# EAGLE design weatherstation (EAGLE 9.6.2)
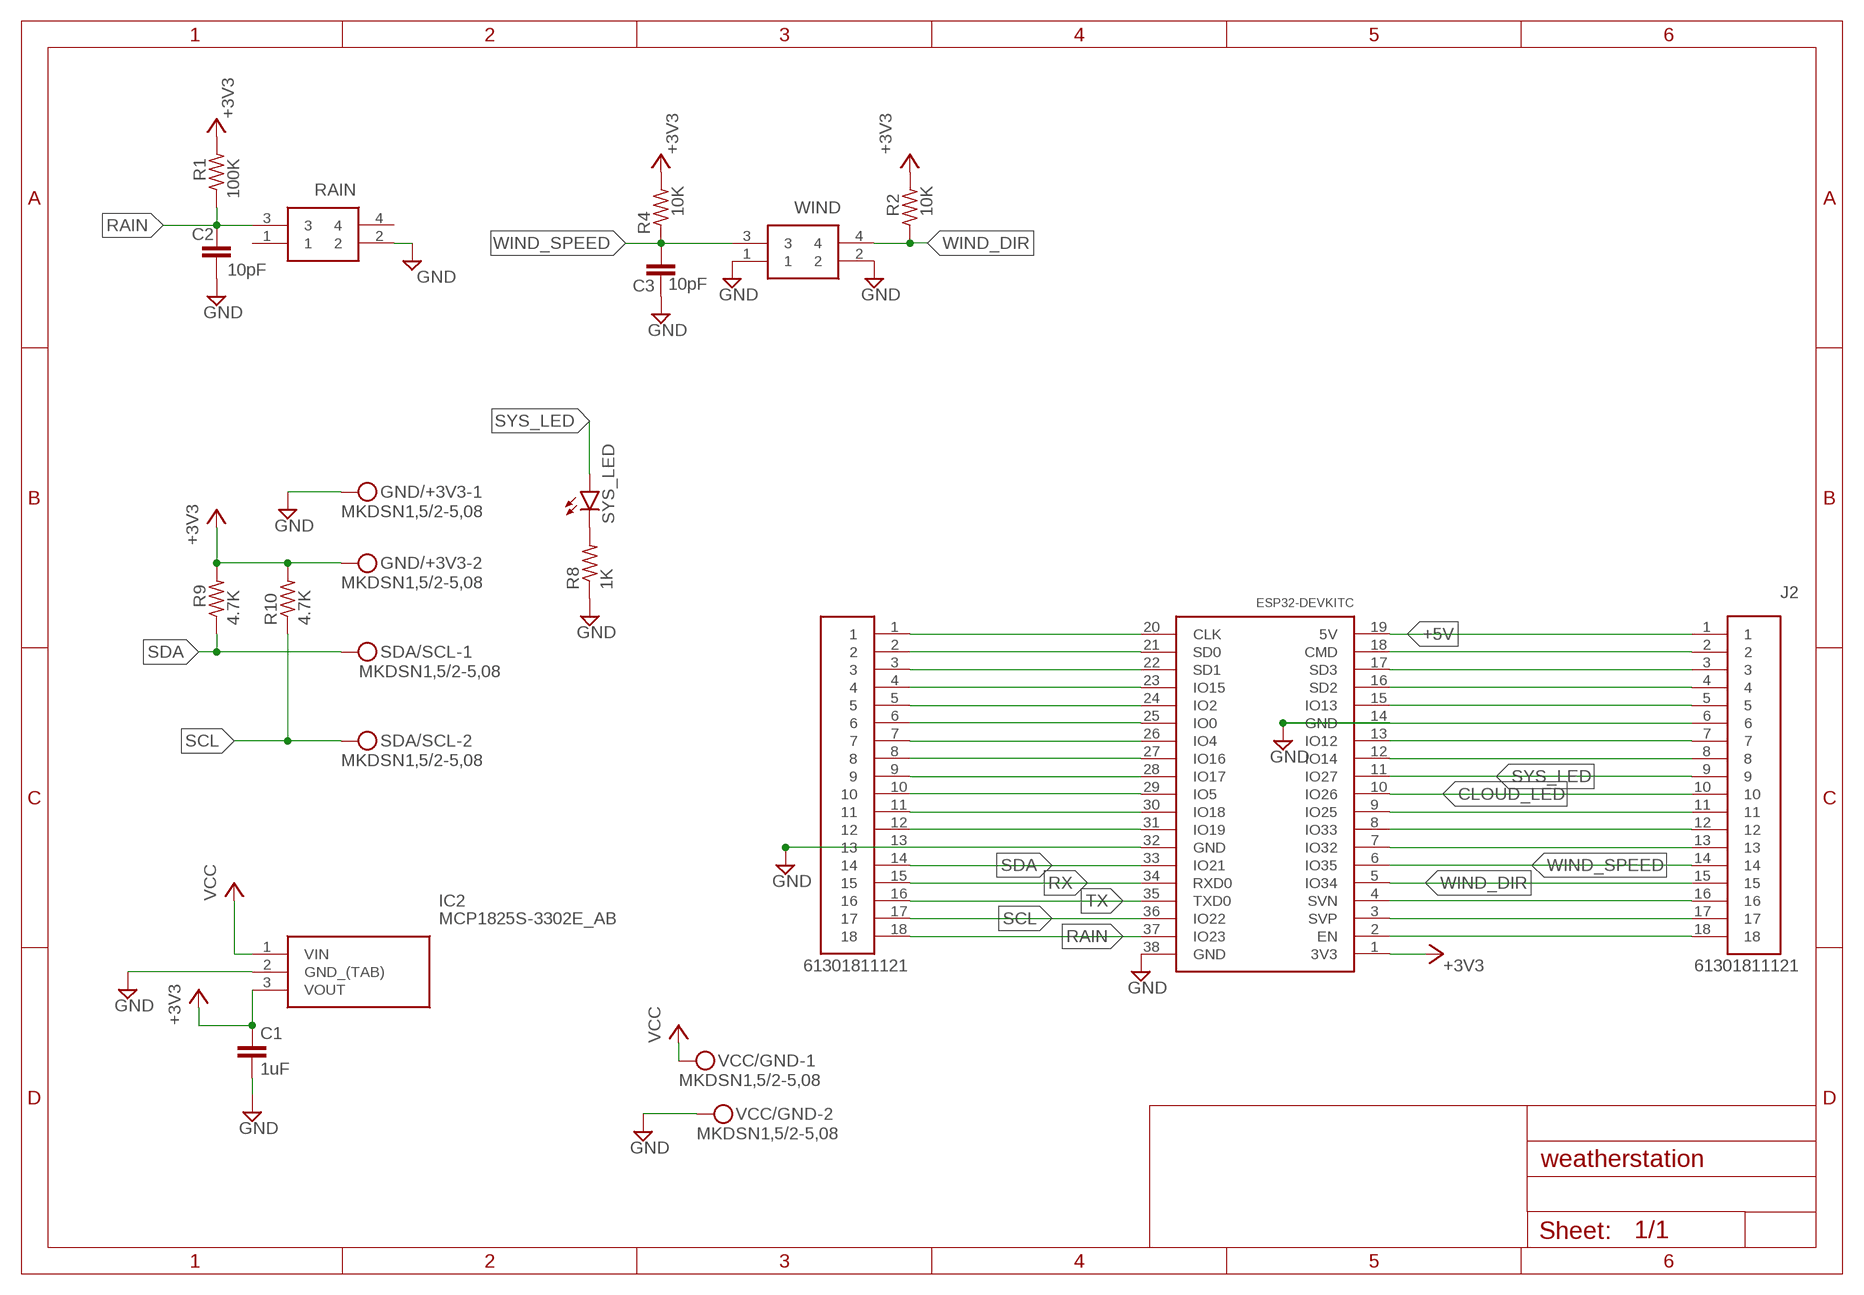
[diagram p0: schematic, sheet 1]

## Parts
C1  1uF  C-EU025-025X050  [C025-025X050]
C2  10pF  C-EU025-025X050  [C025-025X050]
C3  10pF  C-EU025-025X050  [C025-025X050]
GND/+3V3  MKDSN1,5/2-5,08  [MKDSN1,5/2-5,08]
IC2  MCP1825S-3302E_AB  [TO254P482X1024X3124-3P]
J1  61301811121  [61301811121]
J2  61301811121  [61301811121]
R1  100K  R-US_0204/7  [0204/7]
R2  10K  R-US_0204/7  [0204/7]
R4  10K  R-US_0204/7  [0204/7]
R8  1K  R-US_0204/7  [0204/7]
R9  4.7K  R-US_0204/7  [0204/7]
R10  4.7K  R-US_0204/7  [0204/7]
RAIN  TM5RU1-64_50_  [TM5RU16450]
SDA/SCL  MKDSN1,5/2-5,08  [MKDSN1,5/2-5,08]
SYS_LED  LED5MM  [LED5MM]
U$1  ESP32DEVKITC  [ESP32-DEVKITC]
VCC/GND  MKDSN1,5/2-5,08  [MKDSN1,5/2-5,08]
WIND  TM5RU1-64_50_  [TM5RU16450]

## Nets
+3V3: C1.1 GND/+3V3.2 IC2.3(VOUT) R1.2 R2.2 R4.2 R9.2 R10.2 U$1.1(3V3)
+5V: J2.1 U$1.19(5V)
CLOUD_LED: J2.10 U$1.10(IO26)
GND: C1.2 C2.2 C3.2 GND/+3V3.1 IC2.2(GND_(TAB)) J1.13 J2.6 R8.1 RAIN.2 U$1.14(GND) U$1.32(GND) U$1.38(GND) VCC/GND.2 WIND.1 WIND.2
N$1: J1.1 U$1.20(CLK)
N$3: J1.2 U$1.21(SD0)
N$4: J1.3 U$1.22(SD1)
N$5: J1.4 U$1.23(IO15)
N$6: J1.5 U$1.24(IO2)
N$7: R8.2 SYS_LED.K(C)
N$8: J1.6 U$1.25(IO0)
N$9: J1.7 U$1.26(IO4)
N$10: J1.8 U$1.27(IO16)
N$11: J1.9 U$1.28(IO17)
N$12: J1.10 U$1.29(IO5)
N$13: J1.11 U$1.30(IO18)
N$14: J1.12 U$1.31(IO19)
N$15: J2.2 U$1.18(CMD)
N$16: J2.3 U$1.17(SD3)
N$17: J2.4 U$1.16(SD2)
N$18: J2.5 U$1.15(IO13)
N$19: J2.7 U$1.13(IO12)
N$20: J2.8 U$1.12(IO14)
N$21: J2.11 U$1.9(IO25)
N$22: J2.12 U$1.8(IO33)
N$23: J2.13 U$1.7(IO32)
N$24: J2.16 U$1.4(SVN)
N$25: J2.17 U$1.3(SVP)
N$26: J2.18 U$1.2(EN)
RAIN: C2.1 J1.18 R1.1 RAIN.3 U$1.37(IO23)
RX: J1.15 U$1.34(RXD0)
SCL: J1.17 R10.1 SDA/SCL.2 U$1.36(IO22)
SDA: J1.14 R9.1 SDA/SCL.1 U$1.33(IO21)
SYS_LED: J2.9 SYS_LED.A U$1.11(IO27)
TX: J1.16 U$1.35(TXD0)
VCC: IC2.1(VIN) VCC/GND.1
WIND_DIR: J2.15 R2.1 U$1.5(IO34) WIND.4
WIND_SPEED: C3.1 J2.14 R4.1 U$1.6(IO35) WIND.3
Unconnected: RAIN.1 RAIN.4

## Library data of the parts
C1-C3 = rcl:C-EU: CAPACITOR, European symbol; SPICEPREFIX: C
GND/+3V3 SDA/SCL VCC/GND = con-phoenix-508:MKDSN1,5/2-5,08: MKDSN 1,5/ 2-5,08 Printklemme Nennstrom: 13,5 A Nennspannung: 250 V Rastermaß: 5,08 mm Polzahl: 2 Anschlussart: Schraubanschluss Montage: Löten Anschlussrichtung Leiter/Platine: 0 ° Artikelnummer: 1729128 Source: http://eshop.phoenixcontact.com .. 1729128.pdf
IC2 = MCP1825S-3302E_AB:MCP1825S-3302E_AB: IC LDO REG 500MA 3.3V Source: Datasheet <http://uk.rs-online.com/web/p/products/6695083P>; ALLIED_NUMBER: 70046537; DESCRIPTION: IC LDO REG 500MA 3.3V; HEIGHT: mm; MANUFACTURER_NAME: Microchip; MANUFACTURER_PART_NUMBER: MCP1825S-3302E/AB; RS_PART_NUMBER: 6695083P; RS_PRICE-STOCK: http://uk.rs-online.com/web/p/products/6695083P
J1 J2 = Headers:61301811121: CONN HEADER VERT 18POS 2.54MM Manufacturer's datasheet <https://katalog.we-online.de/em/datasheet/6130xx11121.pdf>; CREATED_BY: PCBLayout.com; DIGIKEY_PART_NUMBER: 732-5328-ND; MANUFACTURER: Wurth Electronics Inc.; MPN: 61301811121
R1 R2 R4 R8-R10 = rcl:R-US_: RESISTOR, American symbol; SPICEPREFIX: R
RAIN WIND = TM5RU1-64_50_:TM5RU1-64_50_: Modular Connectors / Ethernet Connectors 4P F MODULAR JACK BRD MNT THROUGH HOLE Source: Datasheet <http://uk.rs-online.com/web/p/products/7644828>; DESCRIPTION: Modular Connectors / Ethernet Connectors 4P F MODULAR JACK BRD MNT THROUGH HOLE; HEIGHT: 22mm; MANUFACTURER_NAME: Hirose; MANUFACTURER_PART_NUMBER: TM5RU1-64(50); RS_PART_NUMBER: 7644828; RS_PRICE-STOCK: http://uk.rs-online.com/web/p/products/7644828
SYS_LED = led:LED: LED OSRAM: - CHIPLED LG R971, LG N971, LY N971, LG Q971, LY Q971, LO R971, LY R971 LH N974, LH R974 LS Q976, LO Q976, LY Q976 LO Q996 - Hyper CHIPLED LW Q18S LB Q993, LB Q99A, LB R99A - SideLED LS A670, LO A670, LY A670, LG A670, LP A670 LB A673, LV A673, LT A673, LW A673 LH A674 LY A675 LS A676, LA A676, LO A676, LY A676, LW A676 LS A679, LY A679, LG A679 - Hyper Micro SIDELED® LS Y876, LA Y876, LO Y876, LY Y876 LT Y87S - SmartLED LW L88C, LW L88S LB L89C, LB L89S, LG L890 LS L89K, LO L89K, LY L89K LS L896, LA L896, LO L896, LY L896 - TOPLED LS T670, LO T670, LY T670, LG T670, LP T670 LSG T670, LSP T670, LSY T670, LOP T670, LYG T670 LG T671, LOG T671, LSG T671 LB T673, LV T673, LT T673, LW T673 LH T674 LS T676, LA T676, LO T676, LY T676, LB T676, LH T676, LSB T676, LW T676 LB T67C, LV T67C, LT T67C, LS T67K, LO T67K, LY T67K, LW E67C LS E67B, LA E67B, LO E67B, LY E67B, LB E67C, LV E67C, LT E67C LW T67C LS T679, LY T679, LG T679 LS T770, LO T770, LY T770, LG T770, LP T770 LB T773, LV T773, LT T773, LW T773 LH T774 LS E675, LA E675, LY E675, LS T675 LS T776, LA T776, LO T776, LY T776, LB T776 LHGB T686 LT T68C, LB T68C - Hyper Mini TOPLED® LB M676 - Mini TOPLED Santana® LG M470 LS M47K, LO M47K, LY M47K Source: http://www.osram.convergy.de LUXEON: - LUMILED® LXK2-PW12-R00, LXK2-PW12-S00, LXK2-PW14-U00, LXK2-PW14-V00 LXK2-PM12-R00, LXK2-PM12-S00, LXK2-PM14-U00 LXK2-PE12-Q00, LXK2-PE12-R00, LXK2-PE12-S00, LXK2-PE14-T00, LXK2-PE14-U00 LXK2-PB12-K00, LXK2-PB12-L00, LXK2-PB12-M00, LXK2-PB14-N00, LXK2-PB14-P00, LXK2-PB14-Q00 LXK2-PR12-L00, LXK2-PR12-M00, LXK2-PR14-Q00, LXK2-PR14-R00 LXK2-PD12-Q00, LXK2-PD12-R00, LXK2-PD12-S00 LXK2-PH12-R00, LXK2-PH12-S00 LXK2-PL12-P00, LXK2-PL12-Q00, LXK2-PL12-R00 Source: www.luxeon.com KINGBRIGHT: KA-3528ASYC Source: www.kingbright.com
U$1 = ESP32-DEVKITC:ESP32DEVKITC

## Board
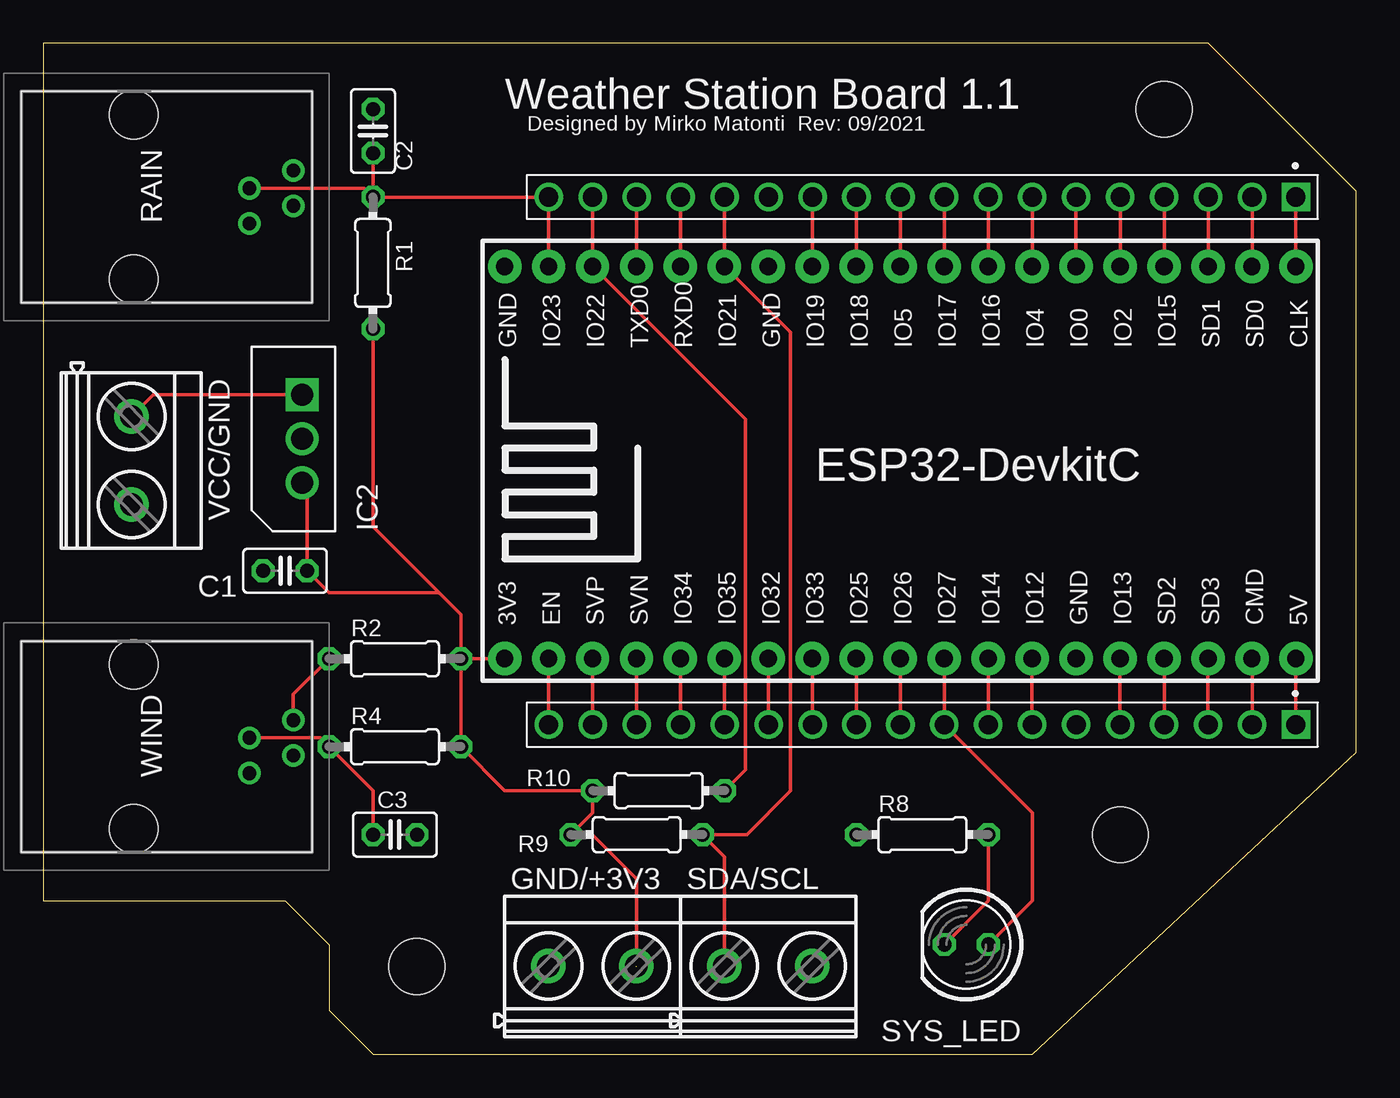
[diagram p1: board, top side]
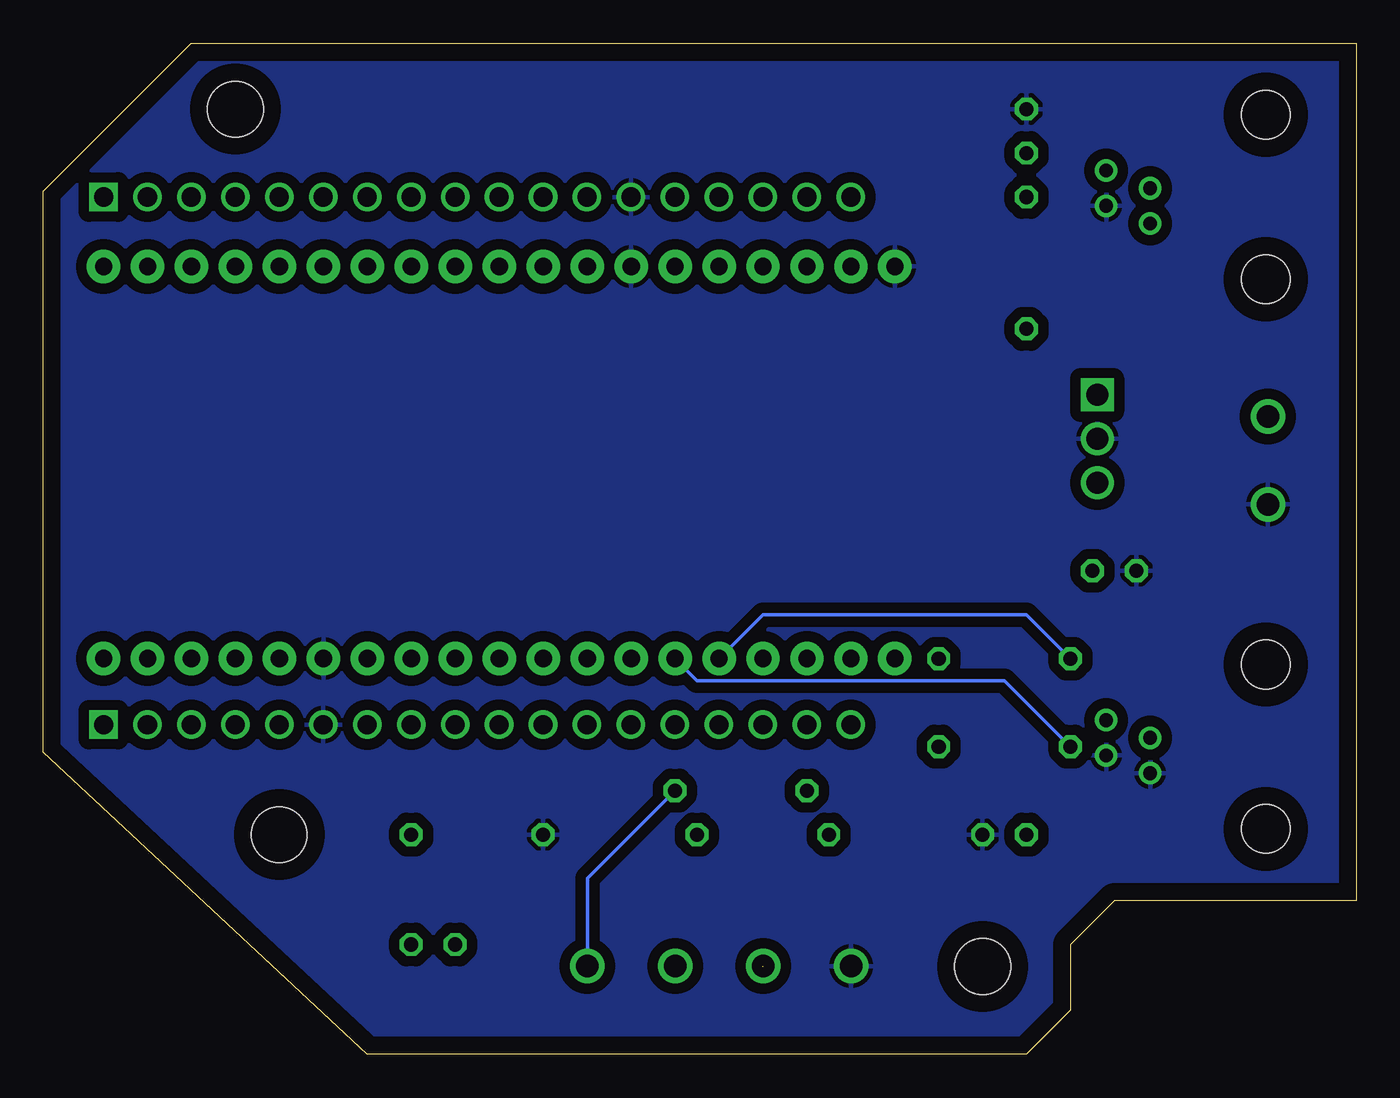
[diagram p2: board, bottom side, seen from below]

Size 75.87 x 58.41 mm. Coordinates in mm from the lower left corner, seen from the top.
Outline: 67.32,58.41 0,58.41 0,8.89 13.97,8.89 16.51,6.35 16.51,2.54 19.05,0 57.15,0 75.87,17.45 75.87,49.86 67.32,58.41
Copper layers (1*16): Top 0.035mm / dielectric 1.5mm / Bottom 0.035mm
Design rules "default": minimum track width 6mil, minimum drill 0.35mm, track to track 6mil, track to pad 6mil, pad to pad 6mil, via to via 6mil, smd to smd 6mil, copper to edge 40mil, drill to drill 6mil, minimum pad ring 10mil, minimum via ring 8mil, stop-mask expansion 4mil, vias tented up to drill 0mil, thermal gap 10mil
Holes 3.2 mm at 62.23,12.7 21.59,5.08 64.77,54.61

### Footprints (pad centres in the part's own frame; a part is rotated, then mirrored left to right if it is on the bottom)
C025-025X050 = drill 0.813 octagon: 1 -1.27,0; 2 1.27,0
MKDSN1,5/2-5,08 = drill 1.3 pad 2: 1 -2.561,0.025; 2 2.519,0.025
TO254P482X1024X3124-3P = drill 1.27 pad 1.905 square: 1 -5.08,0.991 | drill 1.27 pad 1.905: 2 -2.54,0.991; 3 0,0.991
61301811121 = drill 1.1 square: 1 -21.59,0 | drill 1.1: 2 -19.05,0; 3 -16.51,0; 4 -13.97,0; 5 -11.43,0; 6 -8.89,0; 7 -6.35,0; 8 -3.81,0; 9 -1.27,0; 10 1.27,0; 11 3.81,0; 12 6.35,0; 13 8.89,0; 14 11.43,0; 15 13.97,0; 16 16.51,0; 17 19.05,0; 18 21.59,0
0204/7 = drill 0.813 octagon: 1 -3.81,0; 2 3.81,0
TM5RU16450 = drill 0.8 pad 1.3: 1 1.53,13.18; 2 0.51,15.72; 3 -0.51,13.18; 4 -1.53,15.72 | hole 2.8: 4.75,6.5; -4.75,6.5
LED5MM = drill 0.813 octagon: A -1.27,0; K 1.27,0
ESP32-DEVKITC = drill 1 pad 1.93: 1 -22.87,-11.42; 2 -20.33,-11.42; 3 -17.79,-11.42; 4 -15.25,-11.42; 5 -12.71,-11.42; 6 -10.17,-11.42; 7 -7.63,-11.42; 8 -5.09,-11.42; 9 -2.55,-11.42; 10 -0.01,-11.42; 11 2.53,-11.42; 12 5.07,-11.42; 13 7.61,-11.42; 14 10.15,-11.42; 15 12.69,-11.42; 16 15.23,-11.42; 17 17.77,-11.42; 18 20.31,-11.42; 19 22.85,-11.42; 20 22.85,11.23; 21 20.31,11.23; 22 17.77,11.23; 23 15.23,11.23; 24 12.69,11.23; 25 10.15,11.23; 26 7.61,11.23; 27 5.07,11.23; 28 2.53,11.23; 29 -0.01,11.23; 30 -2.55,11.23; 31 -5.09,11.23; 32 -7.63,11.23; 33 -10.17,11.23; 34 -12.71,11.23; 35 -15.25,11.23; 36 -17.79,11.23; 37 -20.33,11.23; 38 -22.87,11.23

### Placement (x,y rotation side)
C1  13.97,27.94 180 top
C2  19.05,53.34 90 top
C3  20.32,12.7 0 top
GND/+3V3  31.75,5.08 0 top
IC2  13.97,33.02 270 top
J1  50.8,49.53 180 top
J2  50.8,19.05 180 top
R1  19.05,45.72 270 top
R2  20.32,22.86 0 top
R4  20.32,17.78 0 top
R8  50.8,12.7 0 top
R9  34.29,12.7 180 top
R10  35.56,15.24 180 top
RAIN  -1.27,49.53 270 top
SDA/SCL  41.91,5.08 0 top
SYS_LED  53.34,6.35 180 top
U$1  49.53,34.29 0 top
VCC/GND  5.08,34.29 270 top
WIND  -1.27,17.78 270 top

### Tracks (layer width: path | path; a pad name or v marks a point on that pad's centre or on a via)
+3V3  (1 unrouted)
  Top 0.2: IC2.3 15.24,32.74 C1.1 16.51,26.67 22.86,26.67 | R2.2 U$1.1 | R2.2 24.13,25.4 22.86,26.67 | R2.2 R4.2 26.67,15.24 R10.2 31.75,13.97 R9.2 31.75,12.7 34.29,10.16 34.29,5.08 | 22.86,26.67 19.05,30.48 R1.2
+5V
  Top 0.2: U$1.19 J2.1
CLOUD_LED
  Top 0.2: U$1.10 J2.10
GND
  pour Bottom (isolate 0.61): 0,8.89 0,58.42 67.31,58.42 76.2,49.53 76.2,17.78 58.42,0 19.05,0 16.51,2.54 16.51,6.35 13.97,8.89
N$1
  Top 0.2: J1.1 U$1.20
N$3
  Top 0.2: J1.2 U$1.21
N$4
  Top 0.2: J1.3 U$1.22
N$5
  Top 0.2: J1.4 U$1.23
N$6
  Top 0.2: J1.5 U$1.24
N$7
  Top 0.2: R8.2 54.61,8.89 SYS_LED.K
N$8
  Top 0.2: U$1.25 J1.6
N$9
  Top 0.2: J1.7 U$1.26
N$10
  Top 0.2: J1.8 U$1.27
N$11
  Top 0.2: J1.9 U$1.28
N$12
  Top 0.2: J1.10 U$1.29
N$13
  Top 0.2: U$1.30 J1.11
N$14
  Top 0.2: J1.12 U$1.31
N$15
  Top 0.2: U$1.18 J2.2
N$16
  Top 0.2: J2.3 U$1.17
N$17
  Top 0.2: U$1.16 J2.4
N$18
  Top 0.2: J2.5 U$1.15
N$19
  Top 0.2: J2.7 U$1.13
N$20
  Top 0.2: U$1.12 J2.8
N$21
  Top 0.2: U$1.9 J2.11
N$22
  Top 0.2: J2.12 U$1.8
N$23
  Top 0.2: U$1.7 J2.13
N$24
  Top 0.2: U$1.4 J2.16
N$25
  Top 0.2: U$1.3 J2.17
N$26
  Top 0.2: U$1.2 J2.18
RAIN
  Top 0.2: U$1.37 J1.18 R1.1 | RAIN.3 18.54,50.04 R1.1 | C2.1 R1.1
RX
  Top 0.2: J1.15 U$1.34
SCL
  Top 0.2: J1.17 U$1.36 | U$1.36 | R10.1 40.58,16.45 40.58,36.7 U$1.36
  Bottom 0.2: R10.1 44.43,10.18 SDA/SCL.2
SDA
  Top 0.2: J1.14 U$1.33 | U$1.33 | U$1.33 43.18,41.72 43.18,15.22 40.66,12.7 R9.1 39.37,11.43 39.37,5.13 SDA/SCL.1
SYS_LED
  Top 0.2: U$1.11 J2.9 57.15,13.97 57.15,8.89 SYS_LED.A
TX
  Top 0.2: J1.16 U$1.35
VCC
  Top 0.2: VCC/GND.1 6.35,38.1 IC2.1
WIND_DIR
  Top 0.2: U$1.5 J2.15 | WIND.4 14.45,20.8 R2.1
  Bottom 0.2: R2.1 19.05,25.4 34.29,25.4 U$1.5
WIND_SPEED
  Top 0.2: U$1.6 J2.14 | WIND.3 16,18.29 R4.1 19.05,15.24 C3.1
  Bottom 0.2: R4.1 20.32,21.59 38.1,21.59 39.36,22.85 U$1.6

### Text on the board
tNames: Weather Station Board 1.1 | Designed by Mirko Matonti Rev: 09/2021